# Altium schematic sheet MCU.SchDoc: CATS Telemetry
size A4; Author: Luca Jost; Revision: 1.0; SheetNumber: 2; SheetTotal: 7; Subtitle: MCU
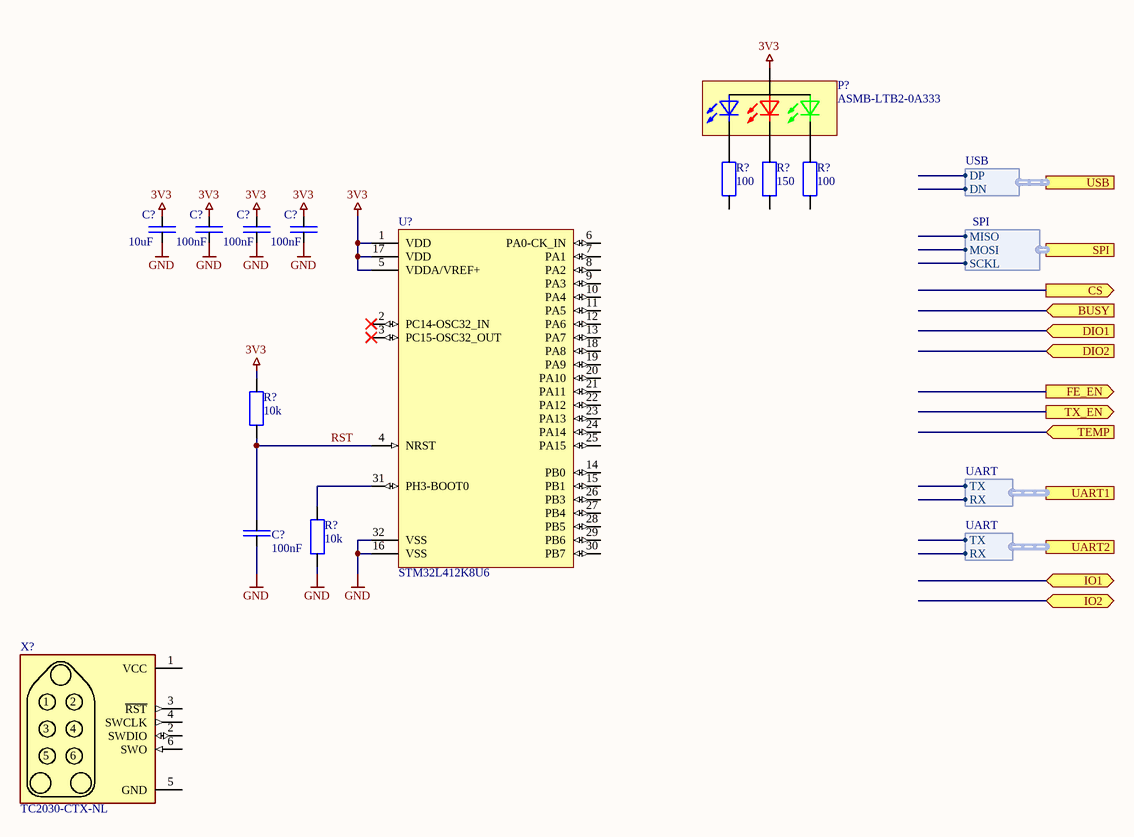
[diagram p0: MCU.SchDoc]

## Parts
(Parts that share a designator on the sheet are numbered #1, #2 ... from top to bottom, then left to right.)
C?#1  10uF  [SMD Keramikkondensator 0603]
C?#2  100nF  [SMD Keramikkondensator 0603]
C?#3  100nF  [SMD Keramikkondensator 0603]
C?#4  100nF  [SMD Keramikkondensator 0603]
C?#5  100nF  [SMD Keramikkondensator 0603]
P?  ASMB-LTB2-0A333  [SMD LED PLCC-4]
R?#1  100  [SMD Widerstand 0805]
R?#2  150  [SMD Widerstand 0805]
R?#3  100  [SMD Widerstand 0805]
R?#4  10k  [SMD Widerstand 0603]
R?#5  10k  [SMD Widerstand 0603]
U?  STM32L412K8U6  [SMD IC QFN-32]
X?  TC2030-CTX-NL  [SMD Connector TC2030 w/ holes]  (no BOM)

## Ports
BUSY (in), CS (out), DIO1 (in), DIO2 (in), FE_EN (out), IO1 (bidir), IO2 (bidir), SPI (harness SPI), TEMP (in), TX_EN (out), UART1 (harness UART), UART2 (harness UART), USB (harness USB)

## Harnesses
USB: DP, DN
SPI: SCKL, MOSI, MISO
UART: TX, RX

## Nets
3V3: C?#1.2 C?#2.2 C?#3.2 C?#4.2 P?.1 R?#4.2 U?.1(VDD) U?.5(VDDA/VREF+) U?.17(VDD)
GND: C?#1.1 C?#2.1 C?#3.1 C?#4.1 C?#5.1 R?#5.2 U?.16(VSS) U?.32(VSS)
RST: C?#5.2 R?#4.1 U?.4(NRST)
NetP?_2: P?.2 R?#2.2
NetP?_3: P?.3 R?#3.2
NetP?_4: P?.4 R?#1.2
NetR?#5_1: R?#5.1 U?.31(PH3-BOOT0)

Not connected (* = marked no-connect by the designer): R?#1 1; R?#2 1; R?#3 1; U? 2(PC14-OSC32_IN)* 3(PC15-OSC32_OUT)* 6(PA0-CK_IN) 7(PA1) 8(PA2) 9(PA3) 10(PA4) 11(PA5) 12(PA6) 13(PA7) 14(PB0) 15(PB1) 18(PA8) 19(PA9) 20(PA10) 21(PA11) 22(PA12) 23(PA13) 24(PA14) 25(PA15) 26(PB3) 27(PB4) 28(PB5) 29(PB6) 30(PB7); X? 1(VCC) 2(SWDIO) 3(~{RST}) 4(SWCLK) 5(GND) 6(SWO)

## Notes on the sheet
- Title
- Author:
- Subtitle
- Date:
- Rev:
- CATS
- Sheet
- of
- File:

## Library data of the parts
C?#1 = E6 - 10uF: SMD Ceramic Capacitor E6; Unit Price: 0.01; Number: -; Supplier: -
C?#2-C?#5 = E6 - 100nF: SMD Ceramic Capacitor E6; Unit Price: 0.01; Number: -; Supplier: -
P? = ASMB-LTB2-0A333: Red, Green, Blue (RGB) 621nm Red, 522nm Green, 468nm Blue LED Indication - Discrete 2.1V Red, 2.9V Green, 2.9V Blue 4-SMD, J-Lead; ComponentLink1Description: Datasheet; ComponentLink1URL: https://docs.broadcom.com/doc/ASMB-LTB2-0A333-2121-Tricolor-PLCC-4-LED-DS
R?#1 R?#3 = E24 - 100: SMD Chip Resistor E24; Unit Price: 0.01; Number: -; Supplier: -
R?#2 = E24 - 150: SMD Chip Resistor E24; Unit Price: 0.01; Number: -; Supplier: -
R?#4 R?#5 = E24 - 10k: SMD Chip Resistor E24; Unit Price: 0.01; Number: -; Supplier: -
U? = STM32L412K8U6: Ultra-low-power with FPU Arm Cortex-M4 MCU 80 MHz with 64 Kbytes of Flash memory, USB; ComponentLink1Description: Datasheet; ComponentLink1URL: https://www.st.com/resource/en/datasheet/stm32l412c8.pdf; Digikey: 497-STM32L412K8U6-ND
X? = TC2030-CTX-NL: Tag-Connect for ARM-Cortex (6-Pin)